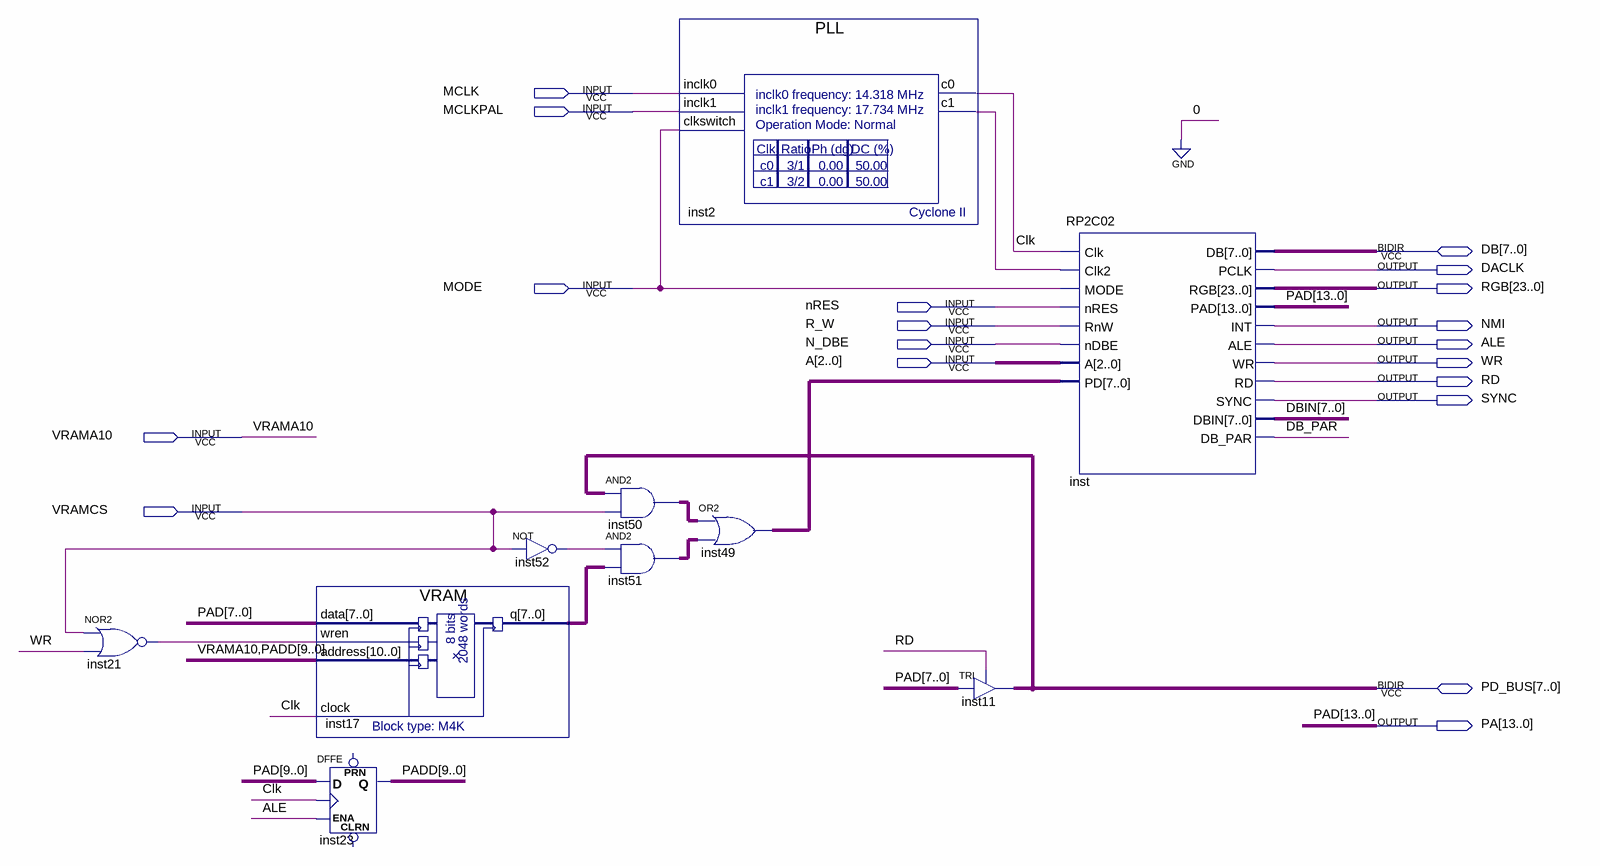
[diagram p0: schematic sheet]
// Quartus schematic V3.bdf as structural Verilog: 10 symbols, 19 pins
module V3 (
  input  MCLK,
  input  MCLKPAL,
  input  MODE,
  input  nRES,
  input  R_W,
  input  N_DBE,
  input  [2:0] A,
  input  VRAMA10,
  input  VRAMCS,
  inout  [7:0] DB,
  inout  [7:0] PD_BUS,
  output DACLK,
  output [23:0] RGB,
  output NMI,
  output ALE,
  output WR,
  output RD,
  output SYNC,
  output [13:0] PA
);

  wire Clk, DB_PAR, inst2_c1, inst21_out, inst52_out;
  wire [7:0] DBIN, inst17_q, inst49_out, inst50_out, inst51_out;
  wire [9:0] PADD;

  nor inst21 (inst21_out, VRAMCS, WR);
  VRAM inst17 (.data(PA[7:0]), .wren(inst21_out), .address({VRAMA10, PADD}), .clock(Clk), .q(inst17_q));
  DFFE inst23[9:0] (.D(PA[9:0]), .CLK(Clk), .ENA(ALE), .Q(PADD));  // open: PRN, CLRN
  not inst52 (inst52_out, VRAMCS);
  assign inst50_out = PD_BUS & {8{VRAMCS}};  // AND2 inst50, 8 bits wide
  assign inst51_out = {8{inst52_out}} & inst17_q;  // AND2 inst51, 8 bits wide
  PLL inst2 (.inclk0(MCLK), .inclk1(MCLKPAL), .clkswitch(MODE), .c0(Clk), .c1(inst2_c1));
  assign inst49_out = inst50_out | inst51_out;  // OR2 inst49, 8 bits wide
  TRI inst11[7:0] (.IN(PA[7:0]), .OE(RD), .OUT(PD_BUS));
  RP2C02 inst (
    .Clk(Clk), .Clk2(inst2_c1), .MODE(MODE), .nRES(nRES), .RnW(R_W), .nDBE(N_DBE), .A(A), .PD(inst49_out),
    .PCLK(DACLK), .RGB(RGB), .PAD(PA), .INT(NMI), .ALE(ALE), .WR(WR), .RD(RD), .SYNC(SYNC), .DBIN(DBIN),
    .DB_PAR(DB_PAR), .DB(DB));

  // Other names for the same wires on the sheet: PAD[13:0] = PA
endmodule
